# Altium schematic sheet PC0_Codec.SchDoc
size 381 x 241 mm
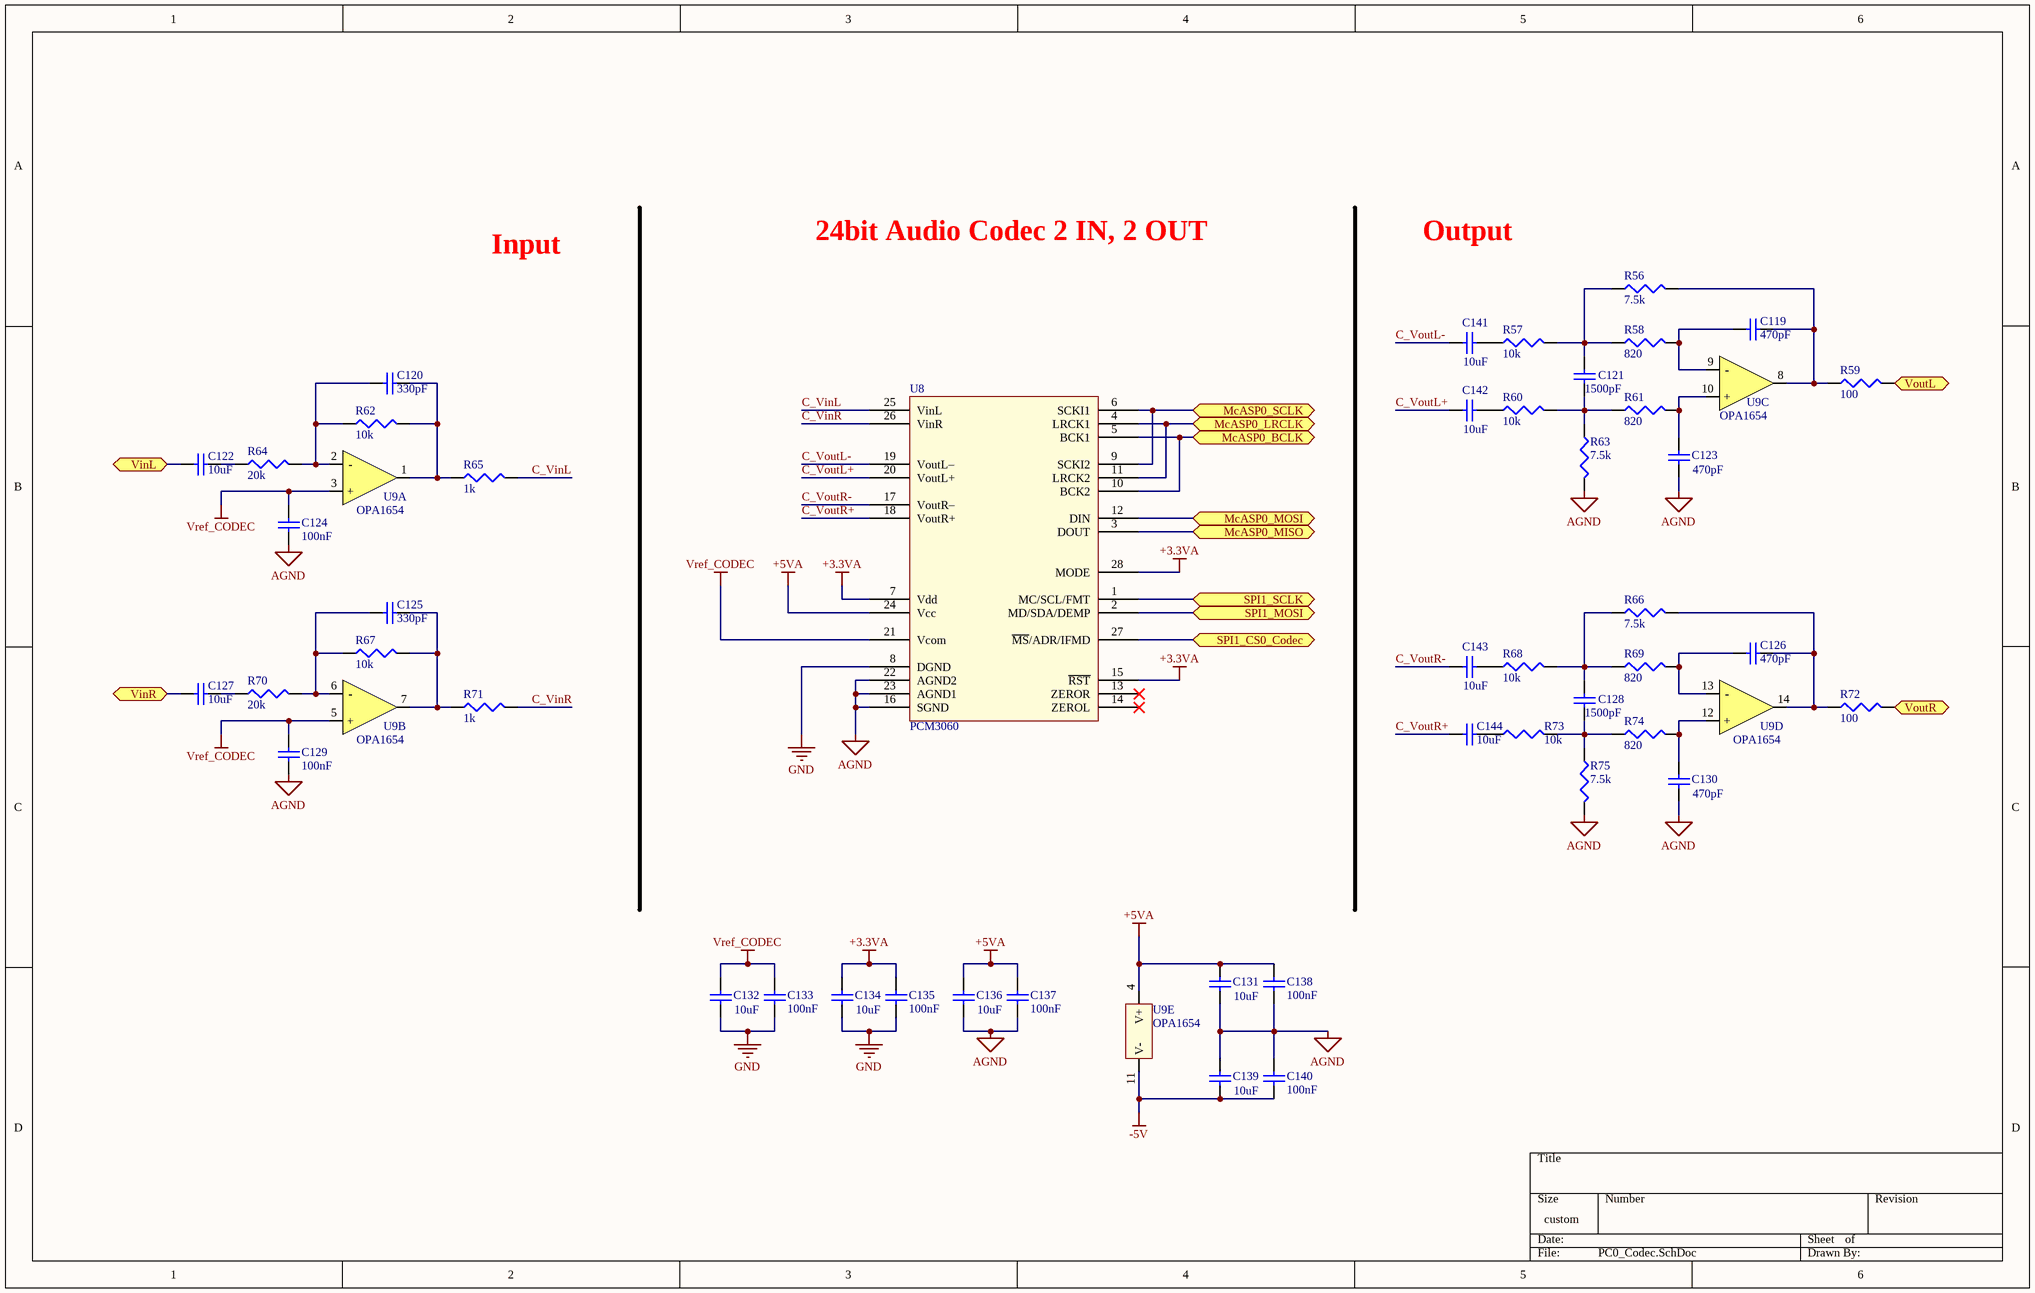
[diagram p0: PC0_Codec.SchDoc]

## Parts
C119  value 470pF  [CAPC1608X08]  (hidden comment: Cap 470pF)
C120  value 330pF  [CAPC1608X08]  (hidden comment: Cap 330pF)
C121  value 1500pF  [CAPC1608X08]  (hidden comment: Cap 1500pF)
C122  value 10uF  [CAPC1608X08]  (hidden comment: Cap 10uF)
C123  value 470pF  [CAPC1608X08]  (hidden comment: Cap 470pF)
C124  value 100nF  [CAPC1608X08]  (hidden comment: Cap 100nF)
C125  value 330pF  [CAPC1608X08]  (hidden comment: Cap 330pF)
C126  value 470pF  [CAPC1608X08]  (hidden comment: Cap 470pF)
C127  value 10uF  [CAPC1608X08]  (hidden comment: Cap 10uF)
C128  value 1500pF  [CAPC1608X08]  (hidden comment: Cap 1500pF)
C129  value 100nF  [CAPC1608X08]  (hidden comment: Cap 100nF)
C130  value 470pF  [CAPC1608X08]  (hidden comment: Cap 470pF)
C131  value 10uF  [CAPC1608X08]  (hidden comment: Cap 10uF)
C132  value 10uF  [CAPC1608X08]  (hidden comment: Cap 10uF)
C133  value 100nF  [CAPC1608X08]  (hidden comment: Cap 100nF)
C134  value 10uF  [CAPC1608X08]  (hidden comment: Cap 10uF)
C135  value 100nF  [CAPC1608X08]  (hidden comment: Cap 100nF)
C136  value 10uF  [CAPC1608X08]  (hidden comment: Cap 10uF)
C137  value 100nF  [CAPC1608X08]  (hidden comment: Cap 100nF)
C138  value 100nF  [CAPC1608X08]  (hidden comment: Cap 100nF)
C139  value 10uF  [CAPC1608X08]  (hidden comment: Cap 10uF)
C140  value 100nF  [CAPC1608X08]  (hidden comment: Cap 100nF)
C141  value 10uF  [CAPC1608X08]  (hidden comment: Cap 10uF)
C142  value 10uF  [CAPC1608X08]  (hidden comment: Cap 10uF)
C143  value 10uF  [CAPC1608X08]  (hidden comment: Cap 10uF)
C144  value 10uF  [CAPC1608X08]  (hidden comment: Cap 10uF)
R56  value 7.5k  [RESC1608X05]  (hidden comment: Res 7.5k)
R57  value 10k  [RESC1608X05]  (hidden comment: Res 10k)
R58  value 820  [RESC1608X05]  (hidden comment: Res 820)
R59  value 100  [RESC1608X05]  (hidden comment: Res 100)
R60  value 10k  [RESC1608X05]  (hidden comment: Res 10k)
R61  value 820  [RESC1608X05]  (hidden comment: Res 820)
R62  value 10k  [RESC1608X05]  (hidden comment: Res 10k)
R63  value 7.5k  [RESC1608X05]  (hidden comment: Res 7.5k)
R64  value 20k  [RESC1608X05]  (hidden comment: Res 20k)
R65  value 1k  [RESC1608X05]  (hidden comment: Res 1k)
R66  value 7.5k  [RESC1608X05]  (hidden comment: Res 7.5k)
R67  value 10k  [RESC1608X05]  (hidden comment: Res 10k)
R68  value 10k  [RESC1608X05]  (hidden comment: Res 10k)
R69  value 820  [RESC1608X05]  (hidden comment: Res 820)
R70  value 20k  [RESC1608X05]  (hidden comment: Res 20k)
R71  value 1k  [RESC1608X05]  (hidden comment: Res 1k)
R72  value 100  [RESC1608X05]  (hidden comment: Res 100)
R73  value 10k  [RESC1608X05]  (hidden comment: Res 10k)
R74  value 820  [RESC1608X05]  (hidden comment: Res 820)
R75  value 7.5k  [RESC1608X05]  (hidden comment: Res 7.5k)
U8  PCM3060  [TSSOP28_PCM3060]
U9  OPA1654  [D14-M]  (parts A,B,C,D,E of 5)

## Ports
McASP0_BCLK, McASP0_LRCLK, McASP0_MISO, McASP0_MOSI, McASP0_SCLK, SPI1_CS0_Codec, SPI1_MOSI, SPI1_SCLK, VinL, VinR, VoutL, VoutR

## Nets
+3.3VA: C134.1 C135.2 U8.7(Vdd) U8.15(~{RST}) U8.28(MODE)
+5VA: C131.1 C136.1 C137.2 C138.2 U8.24(Vcc) U9.4(V+)
-5V: C139.2 C140.1 U9.11(V-)
AGND: C123.2 C124.2 C129.2 C130.2 C131.2 C136.2 C137.1 C138.1 C139.1 C140.2 R63.2 R75.2 U8.16(SGND) U8.22(AGND2) U8.23(AGND1)
GND: C132.2 C133.1 C134.2 C135.1 U8.8(DGND)
Vref_CODEC: C124.1 C129.1 C132.1 C133.2 U8.21(Vcom) U9.3(+) U9.5(+)
C_VinL: R65.2 U8.25(VinL)
C_VinR: R71.2 U8.26(VinR)
C_VoutL+: C142.2 U8.20(VoutL+)
C_VoutL-: C141.2 U8.19(VoutL–)
C_VoutR+: C144.2 U8.18(VoutR+)
C_VoutR-: C143.2 U8.17(VoutR–)
McASP0_BCLK: U8.5(BCK1) U8.10(BCK2) ; port McASP0_BCLK
McASP0_LRCLK: U8.4(LRCK1) U8.11(LRCK2) ; port McASP0_LRCLK
McASP0_MISO: U8.3(DOUT) ; port McASP0_MISO
McASP0_MOSI: U8.12(DIN) ; port McASP0_MOSI
McASP0_SCLK: U8.6(SCKI1) U8.9(SCKI2) ; port McASP0_SCLK
SPI1_CS0_Codec: U8.27(~{MS}/ADR/IFMD) ; port SPI1_CS0_Codec
SPI1_MOSI: U8.2(MD/SDA/DEMP) ; port SPI1_MOSI
SPI1_SCLK: U8.1(MC/SCL/FMT) ; port SPI1_SCLK
VinL: C122.2 ; port VinL
VinR: C127.2 ; port VinR
VoutL: R59.2 ; port VoutL
VoutR: R72.2 ; port VoutR
NetC119_1: C119.1 R56.2 R59.1 U9.8(OUT)
NetC119_2: C119.2 R58.2 U9.9(-)
NetC120_1: C120.1 R62.2 R65.1 U9.1(OUT)
NetC120_2: C120.2 R62.1 R64.2 U9.2(-)
NetC121_1: C121.1 R60.2 R61.1 R63.1
NetC121_2: C121.2 R56.1 R57.2 R58.1
NetC122_1: C122.1 R64.1
NetC123_1: C123.1 R61.2 U9.10(+)
NetC125_1: C125.1 R67.2 R71.1 U9.7(OUT)
NetC125_2: C125.2 R67.1 R70.2 U9.6(-)
NetC126_1: C126.1 R66.2 R72.1 U9.14(OUT)
NetC126_2: C126.2 R69.2 U9.13(-)
NetC127_1: C127.1 R70.1
NetC128_1: C128.1 R73.2 R74.1 R75.1
NetC128_2: C128.2 R66.1 R68.2 R69.1
NetC130_1: C130.1 R74.2 U9.12(+)
NetC141_1: C141.1 R57.1
NetC142_1: C142.1 R60.1
NetC143_1: C143.1 R68.1
NetC144_1: C144.1 R73.1

Not connected (* = marked no-connect by the designer): U8 13(ZEROR)* 14(ZEROL)*

## Notes on the sheet
- Input
- 24bit Audio Codec 2 IN, 2 OUT
- Output

## Library data of the parts
C119 C123 C126 C130 = Cap Semi: Capacitor; Fabricant: MULTICOMP; Fournisseur: Farnell; RefFabricant: MC0603B471K500CT; RefFournisseur: 1759079; Case: 0603 [1608 Metric]; DataSheet: http://www.farnell.com/datasheets/1901289.pdf
C120 C125 = Cap Semi: Capacitor; Fabricant: MULTICOMP; Fournisseur: Farnell; RefFabricant: MC0603B331K500CT; RefFournisseur: 1759075; Case: 0603 [1608 Metric]; DataSheet: http://www.farnell.com/datasheets/1901289.pdf
C121 C128 = Cap Semi: Capacitor; Fabricant: KEMET; Fournisseur: Farnell; RefFabricant: C0603C152K1RACAUTO; RefFournisseur: 2810266; Case: 0603 [1608 Metric]; DataSheet: http://www.farnell.com/datasheets/2048264.pdf
C122 C127 C131 C132 C134 C136 C139 C141-C144 = Cap Semi: Capacitor; Fabricant: TDK; Fournisseur: Farnell; RefFabricant: C1608X5R1A106M080AC; RefFournisseur: 2309028; Case: 0603 [1608 Metric]; DataSheet: http://www.farnell.com/datasheets/2291921.pdf
C124 C129 C133 C135 C137 C138 C140 = Cap Semi: Capacitor; Fabricant: KEMET; Fournisseur: Farnell; RefFabricant: C0603T104K5RALTU; RefFournisseur: 2522432; Case: 0603 [1608 Metric]
R56 R63 R66 R75 = Res3: Resistor; Fabricant: PANASONIC ELECTRONIC COMPONENTS; Fournisseur: Farnell; RefFabricant: ERA3AEB752V; RefFournisseur: 1670187; Case: 0603 [1608 Metric]; DataSheet: http://www.farnell.com/datasheets/2052875.pdf
R57 R60 R62 R67 R68 R73 = Res3: Resistor; Fabricant: TE CONNECTIVITY; Fournisseur: Farnell; RefFabricant: CRGH0603J10K; RefFournisseur: 2331740; Case: 0603 [1608 Metric]; DataSheet: CRGH0603J10K
R58 R61 R69 R74 = Res3: Resistor; Fabricant: TE CONNECTIVITY; Fournisseur: Farnell; RefFabricant: CRGH0603J820R; RefFournisseur: 2331726; Case: 0603 [1608 Metric]; DataSheet: http://www.farnell.com/datasheets/2563624.pdf
R59 R72 = Res3: Resistor; Fabricant: TE CONNECTIVITY; Fournisseur: Farnell; RefFabricant: CRGS0603J100R; RefFournisseur: 2531678; Case: 0603 [1608 Metric]
R64 R70 = Res3: Resistor; Fabricant: PANASONIC ELECTRONIC COMPONENTS; Fournisseur: Farnell; RefFabricant: ERA3AEB203V; RefFournisseur: 1670194; Case: 0603 [1608 Metric]; DataSheet: http://www.farnell.com/datasheets/2052875.pdf
R65 R71 = Res3: Resistor; Fabricant: TE CONNECTIVITY; Fournisseur: Farnell; RefFabricant: CRGH0603F1K0; RefFournisseur: 2332003; Case: 0603 [1608 Metric]; DataSheet: http://www.farnell.com/datasheets/2007183.pdf
U8 = PCM3060: Stereo In/Out Audio Codec; Fabricant: TEXAS INSTRUMENTS; RefFabricant: PCM3060PW; Fournisseur: Farnell; RefFournisseur: 1390706; Datasheet: http://www.ti.com/lit/ds/symlink/pcm3060.pdf
U9 = OPA1654: Quad Audio OpAmp; Fabricant: TEXAS INSTRUMENTS; RefFournisseur: 2099889; Fournisseur: Farnell; RefFabricant: OPA1654; DataSheet: http://www.ti.com/lit/ds/symlink/opa1654.pdf